# Altium schematic sheet Rcd.SchDoc
size A4
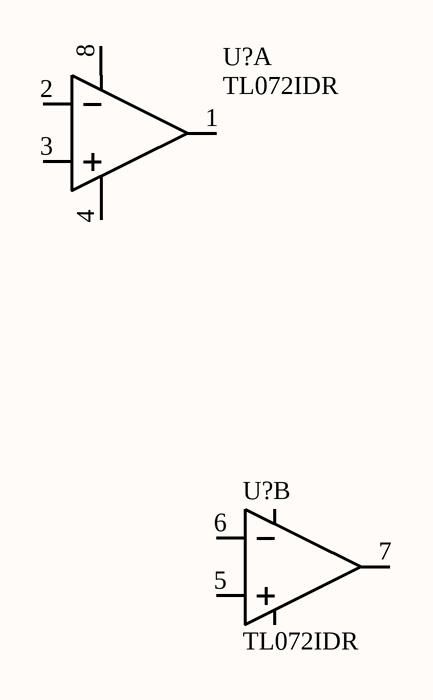
[diagram p0: Rcd.SchDoc]

## Parts
(Parts that share a designator on the sheet are numbered #1, #2 ... from top to bottom, then left to right.)
U?#1  TL072IDR  [SO-8_N]  (part A of 2)
U?#2  TL072IDR  [SO-8_N]  (part B of 2)

## Nets

Not connected (* = marked no-connect by the designer): U?#1 1 2 3 4 8; U?#2 5 6 7

## Library data of the parts
U?#1 U?#2 = UOS1TLC072IT: Dual Operational Amplifier TL072IDR Vcc ±18V Vio 3mV; Manufacturer: TEXAS INSTRUMENTS; TemperatureRange: -40°C to 85°C; Publisher: GreenBox; Published: 1-Jan-2016; PackageReference: SOIC(8); MountType: SMT; VenderID: TL072IDR; PackageDescription: 8-Pin Small Outline Integrated Circuit 1.27 mm Pitch